# Altium schematic sheet 01_Top.SchDoc
size A4; SheetNumber: 1; SheetTotal: 8
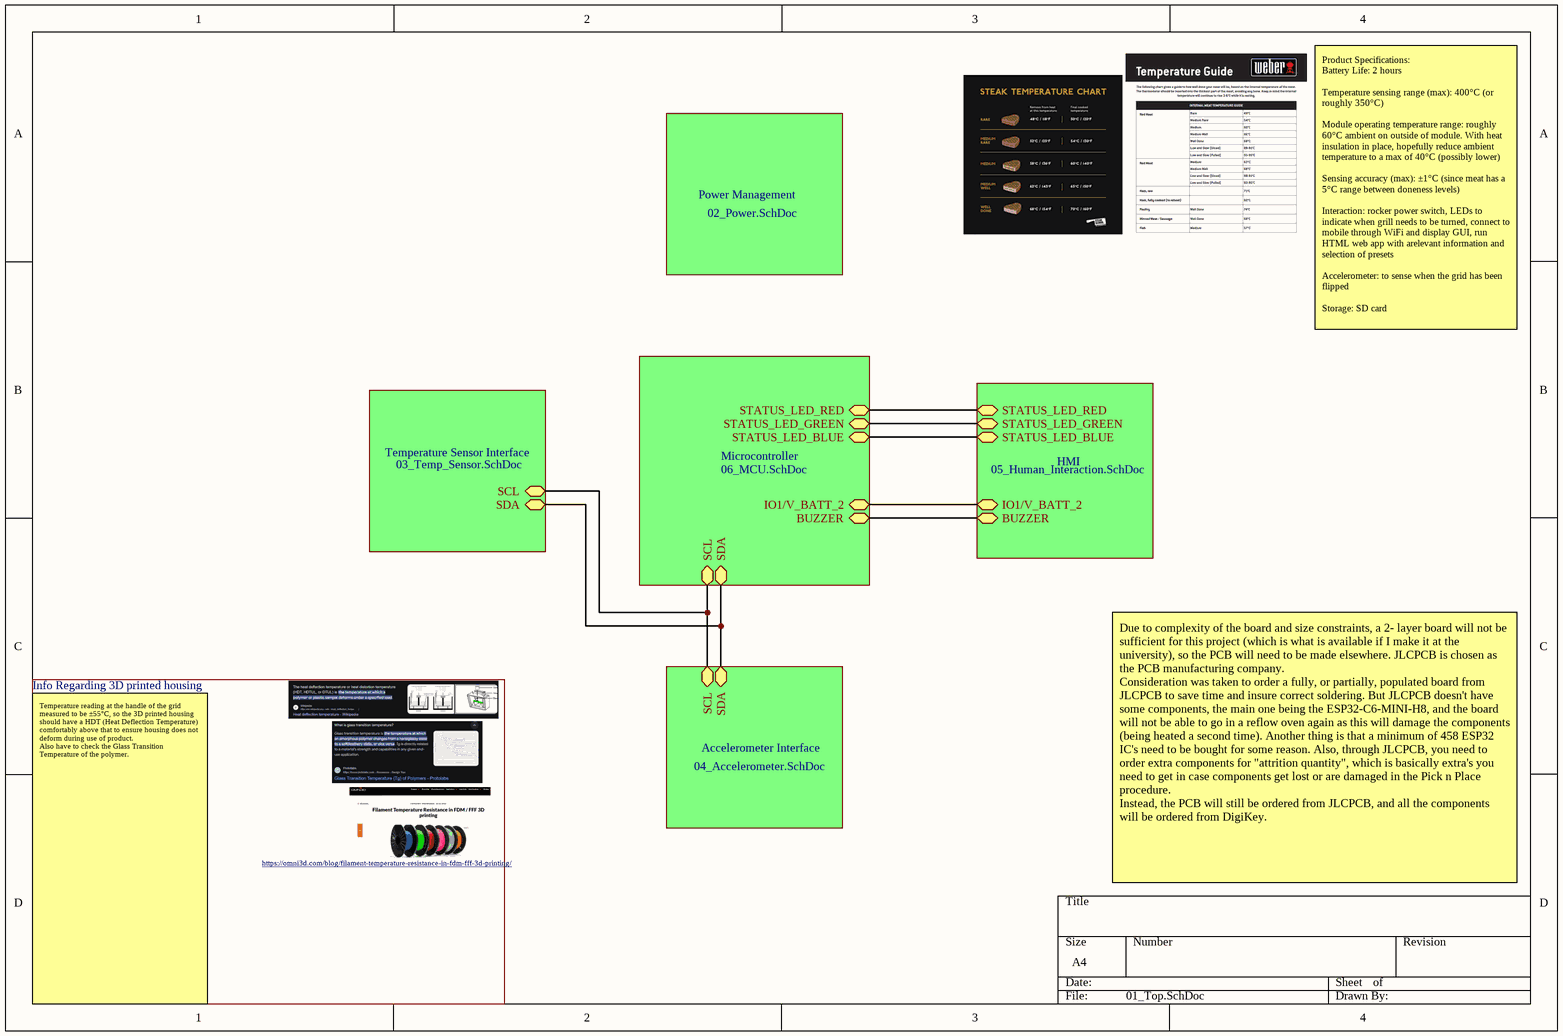
[diagram p0: 01_Top.SchDoc]

## Sub-sheets
Accelerometer Interface = 04_Accelerometer.SchDoc: SCL (bidir), SDA (bidir)
HMI = 05_Human_Interaction.SchDoc: STATUS_LED_RED (bidir), STATUS_LED_GREEN (bidir), STATUS_LED_BLUE (bidir), IO1/V_BATT_2 (bidir), BUZZER (bidir)
Microcontroller = 06_MCU.SchDoc: SCL (bidir), SDA (bidir), IO1/V_BATT_2 (bidir), STATUS_LED_RED (bidir), STATUS_LED_GREEN (bidir), STATUS_LED_BLUE (bidir), BUZZER (bidir)
Power Management = 02_Power.SchDoc: no entries
Temperature Sensor Interface = 03_Temp_Sensor.SchDoc: SCL (bidir), SDA (bidir)

## Nets
(unnamed): sheet Microcontroller/SCL, sheet Temperature Sensor Interface/SCL, sheet Accelerometer Interface/SCL
(unnamed): sheet Microcontroller/SDA, sheet Temperature Sensor Interface/SDA, sheet Accelerometer Interface/SDA
(unnamed): sheet Microcontroller/IO1/V_BATT_2, sheet HMI/IO1/V_BATT_2
(unnamed): sheet Microcontroller/STATUS_LED_RED, sheet HMI/STATUS_LED_RED
(unnamed): sheet Microcontroller/STATUS_LED_GREEN, sheet HMI/STATUS_LED_GREEN
(unnamed): sheet Microcontroller/STATUS_LED_BLUE, sheet HMI/STATUS_LED_BLUE
(unnamed): sheet Microcontroller/BUZZER, sheet HMI/BUZZER

## Notes on the sheet
- Product Specifications:
  Battery Life: 2 hours
  Temperature sensing range (max): 400°C (or roughly 350°C)
  Module operating temperature range: roughly 60°C ambient on outside of module. With heat insulation in place, hopefully reduce ambient temperature to a max of 40°C (possibly lower)
  Sensing accuracy (max): ±1°C (since meat has a 5°C range between doneness levels)
  Interaction: rocker power switch, LEDs to indicate when grill needs to be turned, connect to mobile through WiFi and display GUI, run HTML web app with arelevant information and selection of presets
  Accelerometer: to sense when the grid has been flipped
  Storage: SD card
- Info Regarding 3D printed housing
- https://omni3d.com/blog/filament-temperature-resistance-in-fdm-fff-3d-printing/
- Due to complexity of the board and size constraints, a 2- layer board will not be sufficient for this project (which is what is available if I make it at the university), so the PCB will need to be made elsewhere. JLCPCB is chosen as the PCB manufacturing company.
  Consideration was taken to order a fully, or partially, populated board from JLCPCB to save time and insure correct soldering. But JLCPCB doesn't have some components, the main one being the ESP32-C6-MINI-H8, and the board will not be able to go in a reflow oven again as this will damage the components (being heated a second time). Another thing is that a minimum of 458 ESP32 IC's need to be bought for some reason. Also, through JLCPCB, you need to order extra components for "attrition quantity", which is basically extra's you need to get in case components get lost or are damaged in the Pick n Place procedure.
  Instead, the PCB will still be ordered from JLCPCB, and all the components will be ordered from DigiKey.
- Temperature reading at the handle of the grid measured to be ±55°C, so the 3D printed housing should have a HDT (Heat Deflection Temperature) comfortably above that to ensure housing does not deform during use of product.
  Also have to check the Glass Transition Temperature of the polymer.